# EAGLE schematic SNCHN_II-02p (EAGLE 5.11)
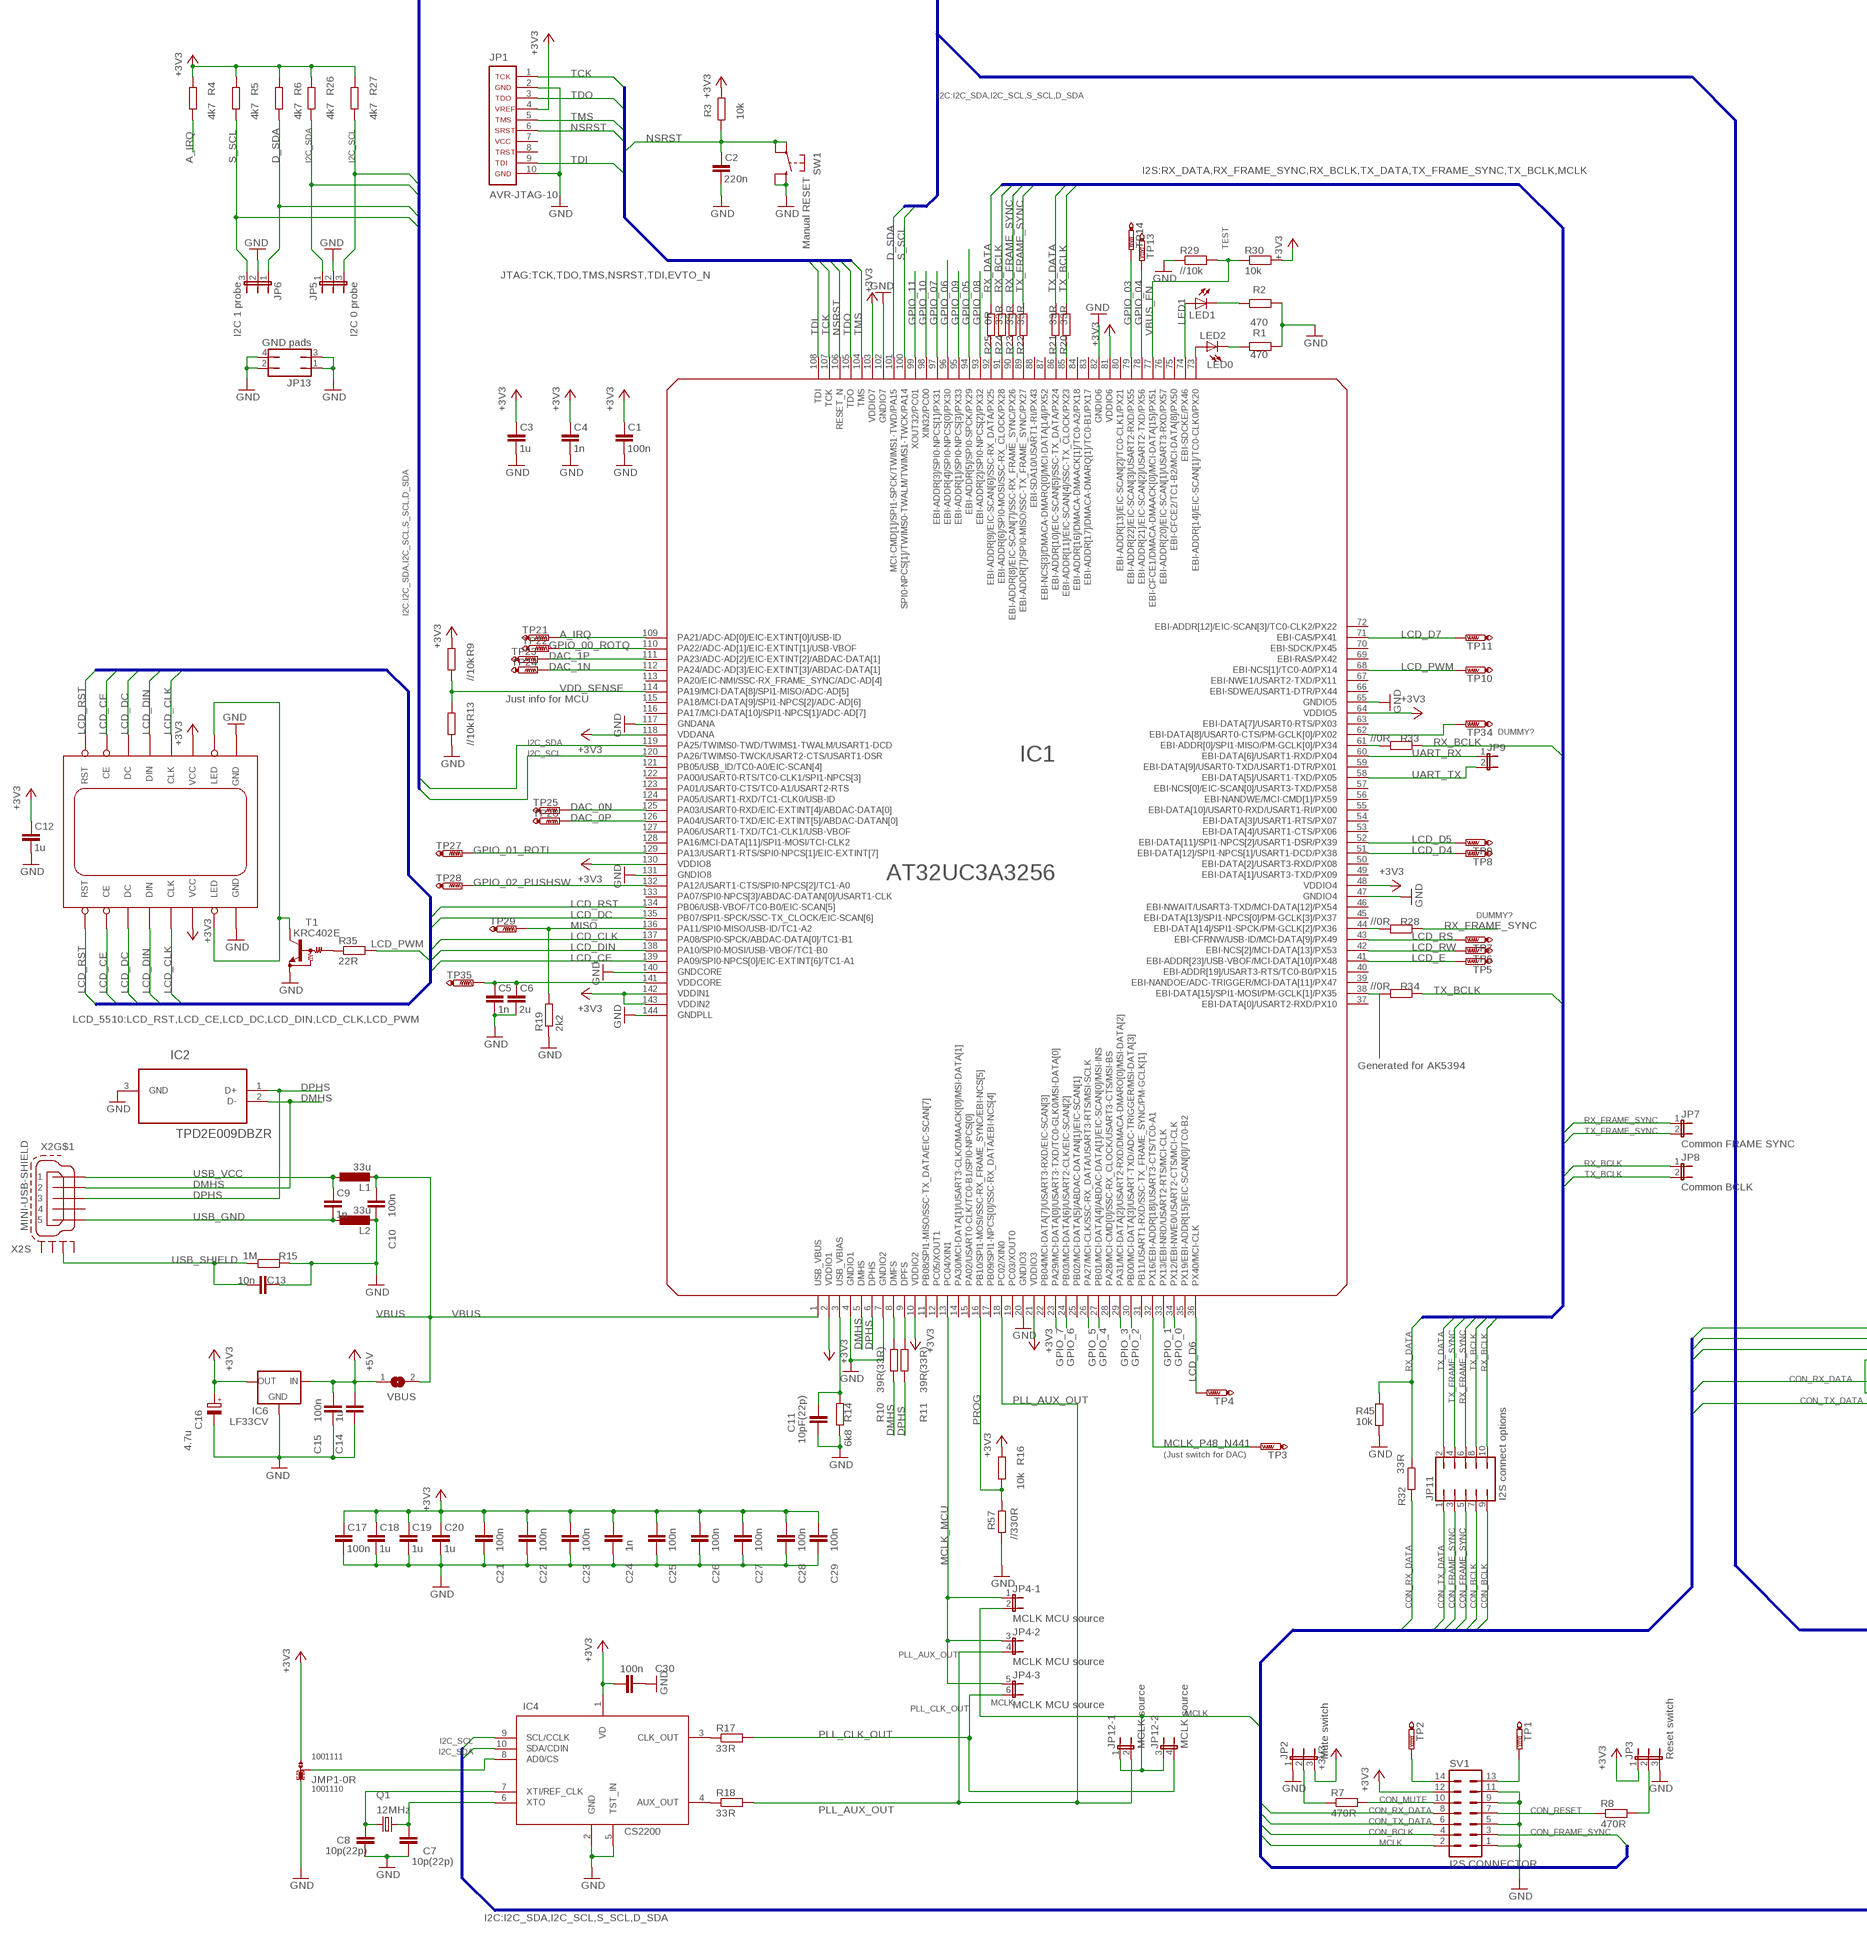
[diagram p0: schematic, sheet 1, part 1 of 2]
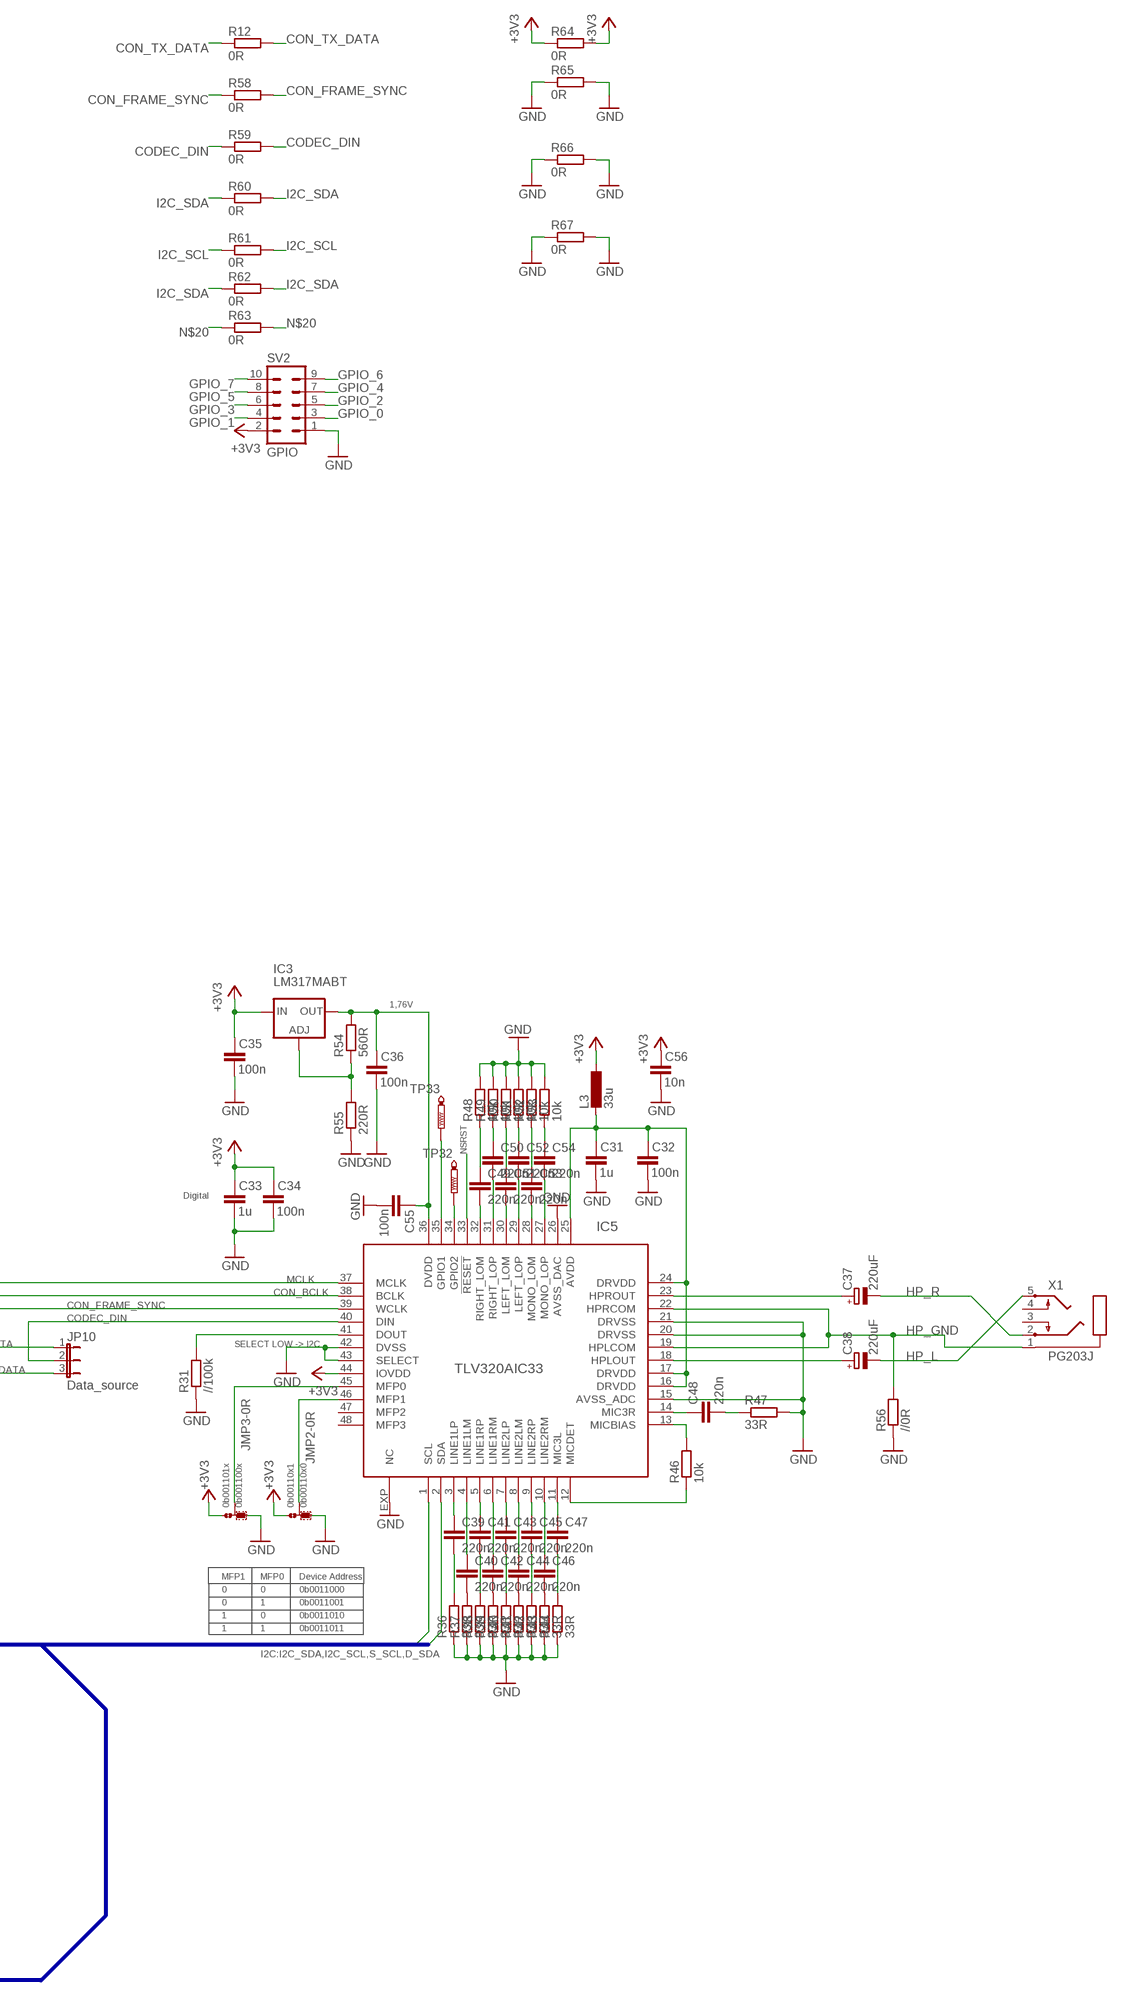
[diagram p1: schematic, sheet 1, part 2 of 2]

## Parts
C1  100n  C-EUC0603  [C0603]
C2  220n  C-EUC0603  [C0603]
C3  1u  C-EUC0603  [C0603]
C4  1n  C-EUC0603  [C0603]
C5  1n  C-EUC0402  [C0402]
C6  2u  C-EUC0805K  [C0805K]
C7  10p(22p)  C-EUC0603  [C0603]
C8  10p(22p)  C-EUC0603  [C0603]
C9  1n  C-EUC0603  [C0603]
C10  100n  C-EUC0603  [C0603]
C11  10pF(22p)  C-EUC0603  [C0603]
C12  1u  C-EUC0603  [C0603]
C13  10n  C-EUC0603  [C0603]
C14  1u  C-EUC0603  [C0603]
C15  100n  C-EUC0603  [C0603]
C16  4.7u  CPOL-EUA/3216-18W  [A/3216-18W]
C17  100n  C-EUC0603  [C0603]
C18  1u  C-EUC0603  [C0603]
C19  1u  C-EUC0603  [C0603]
C20  1u  C-EUC0603  [C0603]
C21  100n  C-EUC0603  [C0603]
C22  100n  C-EUC0402  [C0402]
C23  100n  C-EUC0603  [C0603]
C24  1n  C-EUC0603  [C0603]
C25  100n  C-EUC0603  [C0603]
C26  100n  C-EUC0603  [C0603]
C27  100n  C-EUC0402  [C0402]
C28  100n  C-EUC0603  [C0603]
C29  100n  C-EUC0402  [C0402]
C30  100n  C-EUC0402  [C0402]
C31  1u  C-EUC0603  [C0603]
C32  100n  C-EUC0603  [C0603]
C33  1u  C-EUC0603  [C0603]
C34  100n  C-EUC0402  [C0402]
C35  100n  C-EUC0603  [C0603]
C36  100n  C-EUC0603  [C0603]
C37  220uF  CPOL-EU140CLH-1010  [140CLH-1010]
C38  220uF  CPOL-EU140CLH-1010  [140CLH-1010]
C39  220n  C-EUC0402  [C0402]
C40  220n  C-EUC0402  [C0402]
C41  220n  C-EUC0402  [C0402]
C42  220n  C-EUC0402  [C0402]
C43  220n  C-EUC0402  [C0402]
C44  220n  C-EUC0402  [C0402]
C45  220n  C-EUC0402  [C0402]
C46  220n  C-EUC0402  [C0402]
C47  220n  C-EUC0402  [C0402]
C48  220n  C-EUC0402  [C0402]
C49  220n  C-EUC0402  [C0402]
C50  220n  C-EUC0402  [C0402]
C51  220n  C-EUC0402  [C0402]
C52  220n  C-EUC0402  [C0402]
C53  220n  C-EUC0402  [C0402]
C54  220n  C-EUC0402  [C0402]
C55  100n  C-EUC0603  [C0603]
C56  10n  C-EUC0402  [C0402]
DIS1  LCD_NOKIA_5510  [LCD_NOKIA_5510_PLUS_EXT_BRD]
IC1  AT32UC3A3256  AT32UC3A3256/3128/364  [LQFP144]
IC2  TPD2E009DBZR  [SOT95P237X112-3N]
IC3  LM317MABT  [TO220L1]
IC4  CS2200  [MSOP10]
IC5  TLV320AIC33  [QFN48]
IC6  LF33CV  78XXS  [78XXS]
JMP1  0R-JUMPA  [A0R-JMP]
JMP2  0R-JUMPA  [A0R-JMP]
JMP3  0R-JUMPA  [A0R-JMP]
JP1  AVR-JTAG-10  [AVR-JTAG-10]
JP2  Mute switch  JP2E  [JP2]
JP3  Reset switch  JP2E  [JP2]
JP4  MCLK MCU source  JP3QE  [JP3Q]
JP5  I2C 0 probe  JP2E  [JP2]
JP6  I2C 1 probe  JP2E  [JP2]
JP7  Common FRAME SYNC  JP1E  [JP1]
JP8  Common BCLK  JP1E  [JP1]
JP9  JP1E  [JP1]
JP10  Data_source  JP2E  [JP2]
JP11  I2S connect options  JP5Q  [JP5Q]
JP12  MCLK source  JP2QE  [JP2Q]
JP13  GND pads  JP2Q  [JP2Q]
L1  33u  L0805  [L0805]
L2  33u  L0805  [L0805]
L3  33u  L0805  [L0805]
LED1  LEDCHIP-LED0603  [CHIP-LED0603]
LED2  LEDCHIP-LED0603  [CHIP-LED0603]
Q1  12MHz  CRYSTALHC49U-V  [HC49U-V]
R1  470  R-EU_R0603  [R0603]
R2  470  R-EU_R0603  [R0603]
R3  10k  R-EU_R0603  [R0603]
R4  4k7  R-EU_R0603  [R0603]
R5  4k7  R-EU_R0603  [R0603]
R6  4k7  R-EU_R0603  [R0603]
R7  470R  R-EU_R0603  [R0603]
R8  470R  R-EU_R0603  [R0603]
R9  //10k  R-EU_R0603  [R0603]
R10  39R(33R)  R-EU_R0603  [R0603]
R11  39R(33R)  R-EU_R0603  [R0603]
R12  0R  R-EU_R1206  [R1206]
R13  //10k  R-EU_R0603  [R0603]
R14  6k8  R-EU_R0603  [R0603]
R15  1M  R-EU_R0603  [R0603]
R16  10k  R-EU_R0603  [R0603]
R17  33R  R-EU_R0402  [R0402]
R18  33R  R-EU_R0402  [R0402]
R19  2k2  R-EU_R0402  [R0402]
R20  33R  R-EU_R0603  [R0603]
R21  33R  R-EU_R0603  [R0603]
R22  33R  R-EU_R0603  [R0603]
R23  33R  R-EU_R0603  [R0603]
R24  33R  R-EU_R0603  [R0603]
R25  0R  R-EU_R0603  [R0603]
R26  4k7  R-EU_R0603  [R0603]
R27  4k7  R-EU_R0603  [R0603]
R28  //0R  R-EU_R0402  [R0402]
R29  //10k  R-EU_R0603  [R0603]
R30  10k  R-EU_R0603  [R0603]
R31  //100k  R-EU_R0402  [R0402]
R32  33R  R-EU_R0603  [R0603]
R33  //0R  R-EU_R0402  [R0402]
R34  //0R  R-EU_R1206  [R1206]
R35  22R  R-EU_R0603  [R0603]
R36  33R  R-EU_R0402  [R0402]
R37  33R  R-EU_R0402  [R0402]
R38  33R  R-EU_R0402  [R0402]
R39  33R  R-EU_R0402  [R0402]
R40  33R  R-EU_R0402  [R0402]
R41  33R  R-EU_R0402  [R0402]
R42  33R  R-EU_R0402  [R0402]
R43  33R  R-EU_R0402  [R0402]
R44  33R  R-EU_R0402  [R0402]
R45  10k  R-EU_R0603  [R0603]
R46  10k  R-EU_R0402  [R0402]
R47  33R  R-EU_R0402  [R0402]
R48  10k  R-EU_R0402  [R0402]
R49  10k  R-EU_R0402  [R0402]
R50  10k  R-EU_R0402  [R0402]
R51  10k  R-EU_R0402  [R0402]
R52  10k  R-EU_R0402  [R0402]
R53  10k  R-EU_R0402  [R0402]
R54  560R  R-EU_R0603  [R0603]
R55  220R  R-EU_R0603  [R0603]
R56  //0R  R-EU_M1206  [M1206]
R57  //330R  R-EU_R0603  [R0603]
R58  0R  R-EU_R1206  [R1206]
R59  0R  R-EU_R1206  [R1206]
R60  0R  R-EU_R1206  [R1206]
R61  0R  R-EU_R1206  [R1206]
R62  0R  R-EU_R1206  [R1206]
R63  0R  R-EU_R1206  [R1206]
R64  0R  R-EU_R0603  [R0603]
R65  0R  R-EU_R1206  [R1206]
R66  0R  R-EU_R1206  [R1206]
R67  0R  R-EU_R1206  [R1206]
SV1  I2S CONNECTOR  ML14  [ML14]
SV2  GPIO  ML10L  [ML10L]
SW1  Manual RESET  B1720SMD  [B1720/SMD]
T1  KRC402E  MUN2211T1-NPN_DRIVER-SC59-BEC  [SC59-BEC]
TP1  PTR1B1,27  [B1,27]
TP2  PTR1B1,27  [B1,27]
TP3  PTR1B1,27  [B1,27]
TP4  PTR1B1,27  [B1,27]
TP5  PTR1B1,27  [B1,27]
TP6  PTR1B1,27  [B1,27]
TP7  PTR1B1,27  [B1,27]
TP8  PTR1B1,27  [B1,27]
TP9  PTR1B1,27  [B1,27]
TP10  PTR1B1,27  [B1,27]
TP11  PTR1B1,27  [B1,27]
TP13  PTR1B1,27  [B1,27]
TP14  PTR1B1,27  [B1,27]
TP21  PTR1B1,27  [B1,27]
TP22  PTR1B1,27  [B1,27]
TP23  PTR1B1,27  [B1,27]
TP24  PTR1B1,27  [B1,27]
TP25  PTR1B1,27  [B1,27]
TP26  PTR1B1,27  [B1,27]
TP27  PTR1B1,27  [B1,27]
TP28  PTR1B1,27  [B1,27]
TP29  PTR1B1,27  [B1,27]
TP32  PTR1B1,27  [B1,27]
TP33  PTR1B1,27  [B1,27]
TP34  PTR1B1,27  [B1,27]
TP35  PTR1B1,27  [B1,27]
VBUS  SJ  [SJ]
X1  PG203J  [PG203J]
X2  MINI-USB-SHIELD  MINI-USB-SCHIELD-32005-201  [32005-201]

## Nets
+3V3: C1.1 C3.1 C4.1 C12.1 C16.+ C17.1 C18.1 C19.1 C20.1 C21.1 C22.1 C23.1 C24.1 C25.1 C26.1 C27.1 C28.1 C29.1 C30.1 C33.1 C34.1 C35.1 C56.1 DIS1.6(VCC) DIS1.6@1(VCC) IC1.2(VDDIO1) IC1.10(VDDIO2) IC1.21(VDDIO3) IC1.48(VDDIO4) IC1.64(VDDIO5) IC1.81(VDDIO6) IC1.103(VDDIO7) IC1.118(VDDANA) IC1.130(VDDIO8) IC1.142(VDDIN1) IC1.143(VDDIN2) IC3.3(IN) IC4.1(VD) IC5.44(IOVDD) IC6.OUT JMP1.3 JMP2.3 JMP3.3 JP1.4 JP2.3 JP3.1 L3.1 R3.2 R4.2 R5.2 R6.2 R9.2 R16.2 R26.2 R27.2 R30.2 R64.1 R64.2 SV1.12 SV2.2
+5V: C14.1 C15.1 IC6.IN VBUS.1
A_IRQ: IC1.109(PA21/ADC-AD[0]/EIC-EXTINT[0]/USB-ID) R4.1 TP21.TP
ANALOG_VCC: C31.1 C32.1 IC5.16(DRVDD) IC5.17(DRVDD) IC5.24(DRVDD) IC5.25(AVDD) L3.2
CODEC_DIN: IC5.40(DIN) JP10.2 R59.1 R59.2
CODEC_DOUT: IC5.41(DOUT) R31.2
CON_BCLK: IC5.38(BCLK) JP11.7 JP11.9 SV1.4
CON_FRAME_SYNC: IC5.39(WCLK) JP11.3 JP11.5 R58.1 R58.2 SV1.3
CON_MUTE: R7.2 SV1.10
CON_RESET: R8.1 SV1.7
CON_RX_DATA: JP10.1 R32.1 SV1.8
CON_TX_DATA: JP10.3 JP11.1 R12.1 R12.2 SV1.6
D_SDA: IC1.101(MCI-CMD[1]/SPI1-SPCK/TWIMS1-TWD/PA15) JP6.1 R6.1
DAC_0N: IC1.125(PA03/USART0-RXD/EIC-EXTINT[4]/ABDAC-DATA[0]) TP25.TP
DAC_0P: IC1.126(PA04/USART0-TXD/EIC-EXTINT[5]/ABDAC-DATAN[0]) TP26.TP
DAC_1N: IC1.112(PA24/ADC-AD[3]/EIC-EXTINT[3]/ABDAC-DATA[1]) TP24.TP
DAC_1P: IC1.111(PA23/ADC-AD[2]/EIC-EXTINT[2]/ABDAC-DATA[1]) TP23.TP
DMHS: IC1.5(DMHS) IC2.2(D-) R10.1 X2.2
DPHS: IC1.6(DPHS) IC2.1(D+) R11.1 X2.3
DVDD_1.76: C36.1 C55.1 IC3.2(OUT) IC5.36(DVDD) R54.2
GCLK0: IC1.62(EBI-DATA[8]/USART0-CTS/PM-GCLK[0]/PX02) TP34.TP
GND: C1.2 C2.2 C3.2 C4.2 C5.2 C6.2 C7.2 C8.2 C10.2 C11.2 C12.2 C13.2 C14.2 C15.2 C16.- C17.2 C18.2 C19.2 C20.2 C21.2 C22.2 C23.2 C24.2 C25.2 C26.2 C27.2 C28.2 C29.2 C30.2 C31.2 C32.2 C33.2 C34.2 C35.2 C36.2 C55.2 C56.2 DIS1.8(GND) DIS1.8@1(GND) IC1.4(GNDIO1) IC1.7(GNDIO2) IC1.20(GNDIO3) IC1.47(GNDIO4) IC1.65(GNDIO5) IC1.82(GNDIO6) IC1.102(GNDIO7) IC1.117(GNDANA) IC1.131(GNDIO8) IC1.140(GNDCORE) IC1.144(GNDPLL) IC2.3(GND) IC4.2(GND) IC4.5(TST_IN) IC5.15(AVSS_ADC) IC5.20(DRVSS) IC5.21(DRVSS) IC5.26(AVSS_DAC) IC5.42(DVSS) IC5.43(SELECT) IC5.EXP(NC) IC6.GND JMP1.1 JMP2.1 JMP3.1 JP1.2 JP1.10 JP2.1 JP3.3 JP5.2 JP6.2 JP13.1 JP13.2 JP13.3 JP13.4 L2.2 R1.2 R2.2 R13.1 R14.1 R15.1 R19.1 R29.1 R31.1 R36.1 R37.1 R38.1 R39.1 R40.1 R41.1 R42.1 R43.1 R44.1 R45.2 R47.2 R48.2 R49.2 R50.2 R51.2 R52.2 R53.2 R55.1 R56.1 R57.1 R65.1 R65.2 R66.1 R66.2 R67.1 R67.2 SV1.1 SV1.5 SV1.9 SV1.11 SV2.1 SW1.P$3 SW1.P$4 T1.E
GPIO_0: IC1.34(PX12/EBI-NWE0/USART2-CTS/MCI-CLK) SV2.3
GPIO_00_ROTQ: IC1.110(PA22/ADC-AD[1]/EIC-EXTINT[1]/USB-VBOF) TP22.TP
GPIO_1: IC1.33(PX13/EBI-NRD/USART2-RTS/MCI-CLK) SV2.4
GPIO_01_ROTI: IC1.129(PA13/USART1-RTS/SPI0-NPCS[1]/EIC-EXTINT[7]) TP27.TP
GPIO_2: IC1.30(PB00/MCI-DATA[3]/USART-TXD/ADC-TRIGGER/MSI-DATA[3]) SV2.5
GPIO_02_PUSHSW: IC1.132(PA12/USART1-CTS/SPI0-NPCS[2]/TC1-A0) TP28.TP
GPIO_03: IC1.79(EBI-ADDR[22]/EIC-SCAN[3]/USART2-RXD/PX55) TP14.TP
GPIO_3: IC1.29(PA31/MCI-DATA[2]/USART2-RXD/DMACA-DMARO[0]/MSI-DATA[2]) SV2.6
GPIO_04: IC1.78(EBI-ADDR[21]/EIC-SCAN[2]/USART2-TXD/PX56) TP13.TP
GPIO_4: IC1.27(PB01/MCI-DATA[4]/ABDAC-DATA[1]/EIC-SCAN[0]/MSI-INS) SV2.7
GPIO_05: IC1.94(EBI-ADDR[5]/SPI0-SPCK/PX29)
GPIO_5: IC1.26(PA27/MCI-CLK/SSC-RX_DATA/USART3-RTS/MSI-SCLK) SV2.8
GPIO_06: IC1.96(EBI-ADDR[4]/SPI0-NPCS[0]/PX30)
GPIO_6: IC1.24(PB03/MCI-DATA[6]/USART2-CLK/EIC-SCAN[2]) SV2.9
GPIO_07: IC1.97(EBI-ADDR[3]/SPI0-NPCS[1]/PX31)
GPIO_7: IC1.23(PA29/MCI-DATA[0]/USART3-TXD/TC0-GLK0/MSI-DATA[0]) SV2.10
GPIO_08: IC1.93(EBI-ADDR[2]/SPI0-NPCS[2]/PX32)
GPIO_09: IC1.95(EBI-ADDR[1]/SPI0-NPCS[3]/PX33)
GPIO_10: IC1.98(XIN32/PC00)
GPIO_11: IC1.99(XOUT32/PC01)
HP_GND: IC5.19(HPLCOM) IC5.22(HPRCOM) R56.2 X1.1
HP_L: C38.- X1.5
HP_R: C37.- X1.2
HPLOUT_TLV: C38.+ IC5.18(HPLOUT)
HPROUT_TLV: C37.+ IC5.23(HPROUT)
I2C_SCL: IC1.120(PA26/TWIMS0-TWCK/USART2-CTS/USART1-DSR) IC4.9(SCL/CCLK) IC5.1(SCL) JP5.3 R27.1 R61.1 R61.2
I2C_SDA: IC1.119(PA25/TWIMS0-TWD/TWIMS1-TWALM/USART1-DCD) IC4.10(SDA/CDIN) IC5.2(SDA) JP5.1 R26.1 R60.1 R60.2 R62.1 R62.2
LCD_CE: DIS1.2(CE) DIS1.2@1(CE) IC1.139(PA09/SPI0-NPCS[0]/EIC-EXTINT[6]/TC1-A1)
LCD_CLK: DIS1.5(CLK) DIS1.5@1(CLK) IC1.137(PA08/SPI0-SPCK/ABDAC-DATA[0]/TC1-B1)
LCD_D4: IC1.51(EBI-DATA[12]/SPI1-NPCS[1]/USART1-DCD/PX38) TP8.TP
LCD_D5: IC1.52(EBI-DATA[11]/SPI1-NPCS[2]/USART1-DSR/PX39) TP9.TP
LCD_D6: IC1.36(PX40/MCI-CLK) TP4.TP
LCD_D7: IC1.71(EBI-CAS/PX41) TP11.TP
LCD_DC: DIS1.3(DC) DIS1.3@1(DC) IC1.135(PB07/SPI1-SPCK/SSC-TX_CLOCK/EIC-SCAN[6])
LCD_DIN: DIS1.4(DIN) DIS1.4@1(DIN) IC1.138(PA10/SPI0-MOSI/USB-VBOF/TC1-B0)
LCD_E: IC1.41(EBI-ADDR[23]/USB-VBOF/MCI-DATA[10]/PX48) TP5.TP
LCD_PWM: IC1.68(EBI-NCS[1]/TC0-A0/PX14) R35.2 TP10.TP
LCD_RS: IC1.43(EBI-CFRNW/USB-ID/MCI-DATA[9]/PX49) TP7.TP
LCD_RST: DIS1.1(RST) DIS1.1@1(RST) IC1.134(PB06/USB-VBOF/TC0-B0/EIC-SCAN[5])
LCD_RW: IC1.42(EBI-NCS[2]/MCI-DATA[13]/PX53) TP6.TP
LED0: IC1.73(EBI-ADDR[14]/EIC-SCAN[1]/TC0-CLK0/PX20) LED2.A
LED1: IC1.74(EBI-SDCKE/PX46) LED1.A
MCLK: IC5.37(MCLK) JP4.2 JP12.1 JP12.3 SV1.2
MCLK_MCU: IC1.13(PC04/XIN1) JP4.1 JP4.3 JP4.5
MCLK_P48_N441: IC1.32(PX16/EBI-ADDR[18]/USART3-CTS/TC0-A1) TP3.TP
MFP0: IC5.45(MFP0) JMP3.2
MFP1: IC5.46(MFP1) JMP2.2
MISO: IC1.136(PA11/SPI0-MISO/USB-ID/TC1-A2) R19.2 TP29.TP
N$1: C8.1 IC4.7(XTI/REF_CLK) Q1.1
N$2: IC4.3(CLK_OUT) R17.1
N$4: JP2.2 R7.1
N$5: IC4.8(AD0/CS) JMP1.2
N$6: JP3.2 R8.2
N$7: SV1.14 TP2.TP
N$8: IC4.4(AUX_OUT) R18.1
N$9: SV1.13 TP1.TP
N$10: IC5.12(MICDET) R46.1
N$11: IC1.85(EBI-ADDR[11]/EIC-SCAN[4]/SSC-TX_CLOCK/PX23) R20.1
N$12: IC1.86(EBI-ADDR[10]/EIC-SCAN[5]/SSC-TX_DATA/PX24) R21.1
N$13: IC1.89(EBI-ADDR[7]/SPI0-MISO/SSC-TX_FRAME_SYNC/PX27) R22.1
N$14: IC1.90(EBI-ADDR[8]/EIC-SCAN[7]/SSC-RX_FRAME_SYNC/PX26) R23.1
N$15: IC1.91(EBI-ADDR[6]/SPI0-MOSI/SSC-RX_CLOCK/PX28) R24.1
N$16: IC1.92(EBI-ADDR[9]/EIC-SCAN[6]/SSC-RX_DATA/PX25) R25.1
N$17: IC1.44(EBI-DATA[14]/SPI1-SPCK/PM-GCLK[2]/PX36) R28.2
N$18: IC1.61(EBI-ADDR[0]/SPI1-MISO/PM-GCLK[0]/PX34) R33.2
N$19: IC1.38(EBI-DATA[15]/SPI1-MOSI/PM-GCLK[1]/PX35) R34.2
N$20: R35.1 R63.1 R63.2 T1.B
N$21: DIS1.7(LED) DIS1.7@1(LED) T1.C
N$22: IC5.13(MICBIAS) R46.2
N$23: C42.2 R39.2
N$24: C39.1 IC5.3(LINE1LP)
N$25: C39.2 R36.2
N$26: C40.1 IC5.4(LINE1LM)
N$27: C41.1 IC5.5(LINE1RP)
N$28: C40.2 R37.2
N$29: C41.2 R38.2
N$30: C42.1 IC5.6(LINE1RM)
N$31: C43.1 IC5.7(LINE2LP)
N$32: C43.2 R40.2
N$33: C44.1 IC5.8(LINE2LM)
N$34: C44.2 R41.2
N$35: C45.1 IC5.9(LINE2RP)
N$36: C45.2 R42.2
N$37: C46.1 IC5.10(LINE2RM)
N$38: C48.1 IC5.14(MIC3R)
N$40: C46.2 R43.2
N$41: C49.1 R48.1
N$42: C49.2 IC5.32(RIGHT_LOM)
N$43: C50.2 IC5.31(RIGHT_LOP)
N$44: C50.1 R49.1
N$45: C51.1 R50.1
N$46: C51.2 IC5.30(LEFT_LOM)
N$47: C47.1 IC5.11(MIC3L)
N$48: C47.2 R44.2
N$49: C52.1 R51.1
N$50: C53.1 R52.1
N$51: C54.1 R53.1
N$52: C52.2 IC5.29(LEFT_LOP)
N$53: C53.2 IC5.28(MONO_LOM)
N$54: C54.2 IC5.27(MONO_LOP)
N$56: C48.2 R47.1
N$57: IC5.35(GPIO1) TP33.TP
N$58: IC5.34(GPIO2) TP32.TP
N$60: IC3.1(ADJ) R54.1 R55.2
N$67: C11.1 IC1.3(USB_VBIAS) R14.2
N$69: IC1.8(DMFS) R10.2
N$74: IC1.9(DPFS) R11.2
N$80: LED1.C R2.1
N$82: LED2.C R1.1
N$83: C7.1 IC4.6(XTO) Q1.2
NSRST: C2.1 IC1.106(RESET_N) IC5.33(!RESET) JP1.6 R3.1 SW1.P$1 SW1.P$2
PLL_AUX_OUT: IC1.18(PC02/XIN0) JP4.4 JP12.2 R18.2
PLL_CLK_OUT: JP4.6 JP12.4 R17.2
PROG: IC1.16(PB10/SPI1-MOSI/SSC-RX_FRAME_SYNC/EBI-NCS[5]) R16.1 R57.2
RX_BCLK: JP8.1 JP11.10 R24.2 R33.1
RX_DATA: R25.2 R32.2 R45.1
RX_FRAME_SYNC: JP7.1 JP11.6 R23.2 R28.1
S_SCL: IC1.100(SPI0-NPCS[1]/TWIMS0-TWALM/TWIMS1-TWCK/PA14) JP6.3 R5.1
TCK: IC1.107(TCK) JP1.1
TDI: IC1.108(TDI) JP1.9
TDO: IC1.105(TDO) JP1.3
TMS: IC1.104(TMS) JP1.5
TX_BCLK: JP8.2 JP11.8 R20.2 R34.1
TX_DATA: JP11.2 R21.2
TX_FRAME_SYNC: JP7.2 JP11.4 R22.2
UART_RX: IC1.60(EBI-DATA[6]/USART1-RXD/PX04) JP9.1
UART_TX: IC1.58(EBI-DATA[5]/USART1-TXD/PX05) JP9.2
USB_GND: C9.2 L2.1 X2.5
USB_SHIELD: C13.1 R15.2 X2.M2(S:S2)
USB_VCC: C9.1 L1.1 X2.1
VBUS: C10.1 IC1.1(USB_VBUS) L1.2 VBUS.2
VBUS_EN: IC1.77(EBI-CFCE1/DMACA-DMAACK[0]/MCI-DATA[15]/PX51) R29.2 R30.1
VDD_SENSE: IC1.114(PA19/MCI-DATA[8]/SPI1-MISO/ADC-AD[5]) R9.1 R13.2
VDDCORE: C5.1 C6.1 IC1.141(VDDCORE) TP35.TP
Unconnected: IC1.11(PB08/SPI1-MISO/SSC-TX_DATA/EIC-SCAN[7]) IC1.12(PC05/XOUT1) IC1.14(PA30/MCI-DATA[1]/USART3-CLK/DMAACK[0]/MSI-DATA[1]) IC1.15(PA02/USART0-CLK/TC0-B1/SPI0-NPCS[0]) IC1.17(PB09/SPI1-NPCS[0]/SSC-RX_DATA/EBI-NCS[4]) IC1.19(PC03/XOUT0) IC1.22(PB04/MCI-DATA[7]/USART3-RXD/EIC-SCAN[3]) IC1.25(PB02/MCI-DATA[5]/ABDAC-DATAN[1]/EIC-SCAN[1]) IC1.28(PA28/MCI-CMD[0]/SSC-RX_CLOCK/USART3-CTS/MSI-BS) IC1.31(PB11/USART1-RXD/SSC-TX_FRAME_SYNC/PM-GCLK[1]) IC1.35(PX19/EBI-ADDR[15]/EIC-SCAN[0]/TC0-B2) IC1.37(EBI-DATA[0]/USART2-RXD/PX10) IC1.39(EBI-NANDOE/ADC-TRIGGER/MCI-DATA[11]/PX47) IC1.40(EBI-ADDR[19]/USART3-RTS/TC0-B0/PX15) IC1.45(EBI-DATA[13]/SPI1-NPCS[0]/PM-GCLK[3]/PX37) IC1.46(EBI-NWAIT/USART3-TXD/MCI-DATA[12]/PX54) IC1.49(EBI-DATA[1]/USART3-TXD/PX09) IC1.50(EBI-DATA[2]/USART3-RXD/PX08) IC1.53(EBI-DATA[4]/USART1-CTS/PX06) IC1.54(EBI-DATA[3]/USART1-RTS/PX07) IC1.55(EBI-DATA[10]/USART0-RXD/USART1-RI/PX00) IC1.56(EBI-NANDWE/MCI-CMD[1]/PX59) IC1.57(EBI-NCS[0]/EIC-SCAN[0]/USART3-TXD/PX58) IC1.59(EBI-DATA[9]/USART0-TXD/USART1-DTR/PX01) IC1.63(EBI-DATA[7]/USART0-RTS/PX03) IC1.66(EBI-SDWE/USART1-DTR/PX44) IC1.67(EBI-NWE1/USART2-TXD/PX11) IC1.69(EBI-RAS/PX42) IC1.70(EBI-SDCK/PX45) IC1.72(EBI-ADDR[12]/EIC-SCAN[3]/TC0-CLK2/PX22) IC1.75(EBI-CFCE2/TC1-B2/MCI-DATA[8]/PX50) IC1.76(EBI-ADDR[20]/EIC-SCAN[1]/USART3-RXD/PX57) IC1.80(EBI-ADDR[13]/EIC-SCAN[2]/TC0-CLK1/PX21) IC1.83(EBI-ADDR[17]/DMACA-DMARQ[1]/TC0-B1/PX17) IC1.84(EBI-ADDR[16]/DMACA-DMAACK[1]/TC0-A2/PX18) IC1.87(EBI-NCS[3]/DMACA-DMARQ[0]/MCI-DATA[14]/PX52) IC1.88(EBI-SDA10/USART1-RI/PX43) IC1.113(PA20/EIC-NMI/SSC-RX_FRAME_SYNC/ADC-AD[4]) IC1.115(PA18/MCI-DATA[9]/SPI1-NPCS[2]/ADC-AD[6]) IC1.116(PA17/MCI-DATA[10]/SPI1-NPCS[1]/ADC-AD[7]) IC1.121(PB05/USB_ID/TC0-A0/EIC-SCAN[4]) IC1.122(PA00/USART0-RTS/TC0-CLK1/SPI1-NPCS[3]) IC1.123(PA01/USART0-CTS/TC0-A1/USART2-RTS) IC1.124(PA05/USART1-RXD/TC1-CLK0/USB-ID) IC1.127(PA06/USART1-TXD/TC1-CLK1/USB-VBOF) IC1.128(PA16/MCI-DATA[11]/SPI1-MOSI/TCI-CLK2) IC1.133(PA07/SPI0-NPCS[3]/ABDAC-DATAN[0]/USART1-CLK) IC5.47(MFP2) IC5.48(MFP3) JP1.7 JP1.8 X1.3 X1.4 X2.4 X2.M1(S:S1) X2.M3(S:S3) X2.M4(S:S4)

## Buses
JTAG:TCK,TDO,TMS,NSRST,TDI,EVTO_N
I2S:RX_DATA,RX_FRAME_SYNC,RX_BCLK,TX_DATA,TX_FRAME_SYNC,TX_BCLK,MCLK
CON_I2S:CON_RX_DATA,CON_TX_DATA,CON_BCLK,MCLK,CON_FRAME_SYNC
I2C:I2C_SDA,I2C_SCL,S_SCL,D_SDA
LCD_5510:LCD_RST,LCD_CE,LCD_DC,LCD_DIN,LCD_CLK,LCD_PWM

## Notes on the sheet
- TEST
- Just info for MCU
- DUMMY?
- DUMMY?
- Generated for AK5394
- 1,76V
- Digital
- SELECT LOW -> I2C
- (Just switch for DAC)
- 0b001101x | 0b001100x | 0b00110x1 | 0b00110x0
- MFP1 | MFP0 | Device Address
- 0 | 0 | 0b0011000
- 0 | 1 | 0b0011001
- 1 | 0 | 0b0011010
- 1 | 1 | 0b0011011
- 1001111
- 1001110

## Library data of the parts
C1-C15 C17-C36 C39-C56 = rcl:C-EU: CAPACITOR, European symbol
C16 C37 C38 = rcl:CPOL-EU: POLARIZED CAPACITOR, European symbol
DIS1 = _ALCZ_Display:LCD_NOKIA_5510: Display from NOKIA 5510 Used SPI interface up to 4Mbit/s. LED backlight is turned on by LOW level!
IC1 = atmel-avr32-michel-rev1_Martin:AT32UC3A3256/3128/364: AT32UC3A3xxx series 256/128/64 kB flash CPU max 84 MHz 64 kB RAM High-Speed USB 2.0 (480 Mbit/s) 110 GPIO 2 TWI 4 USART 2 SPI 1 SSC 6 Timer/Counter
IC2 = esd:TPD2E009DBZR: (6 GBPS) DIFFERENTIAL INTERFACE; MPN: TPD2E009DBZR; OC_FARNELL: 1755715; OC_NEWARK: 14R9549; PACKAGE: SOT-23-3; SUPPLIER: Texas Instruments
IC3 = v-reg:LM317?*: 500 mA Adjustable Output Positive Voltage Regulator Source: http://www.onsemi.co.jp .. LM317M-D.PDF
IC4 = _ALCZ_Mixed_signal_IC:CS2200: Fractional-N Frequency Synthesizer The CS2200-CP supports both I²C and SPI for full software control. by Martin Stejskal
IC5 = _ALCZ_Mixed_signal_IC:TLV320AIC33: Low Power Stereo Audio CODEC for Portable Audio/Telephony 16/20/24/32-Bit Data Supports Rates From 8 kHz to 96 kHz 3D/Bass/Treble/EQ/De-emphasis Effects by Martin Stejskal
IC6 = v-reg:78XXS: VOLTAGE REGULATOR
JMP1-JMP3 = jump-0r-smd:0R-JUMP: SMD 0R 0805 Jumper
JP1 = atmel-avr32-michel-rev1_Martin:AVR-JTAG-10: AVR JTAG Debug/Programming Header
JP2 JP3 JP5 JP6 JP10 = jumper:JP2E: JUMPER
JP4 = jumper:JP3QE: JUMPER
JP7-JP9 = jumper:JP1E: JUMPER
JP11 = jumper:JP5Q: JUMPER
JP12 = jumper:JP2QE: JUMPER
JP13 = jumper:JP2Q: JUMPER
L1-L3 = _ALCZ_Passives:L: INDUCTOR chip
LED1 LED2 = led:LED: LED OSRAM: - CHIPLED LG R971, LG N971, LY N971, LG Q971, LY Q971, LO R971, LY R971 LH N974, LH R974 LS Q976, LO Q976, LY Q976 LO Q996 - Hyper CHIPLED LW Q18S LB Q993, LB Q99A, LB R99A - SideLED LS A670, LO A670, LY A670, LG A670, LP A670 LB A673, LV A673, LT A673, LW A673 LH A674 LY A675 LS A676, LA A676, LO A676, LY A676, LW A676 LS A679, LY A679, LG A679 - Hyper Micro SIDELED® LS Y876, LA Y876, LO Y876, LY Y876 LT Y87S - SmartLED LW L88C, LW L88S LB L89C, LB L89S, LG L890 LS L89K, LO L89K, LY L89K LS L896, LA L896, LO L896, LY L896 - TOPLED LS T670, LO T670, LY T670, LG T670, LP T670 LSG T670, LSP T670, LSY T670, LOP T670, LYG T670 LG T671, LOG T671, LSG T671 LB T673, LV T673, LT T673, LW T673 LH T674 LS T676, LA T676, LO T676, LY T676, LB T676, LH T676, LSB T676, LW T676 LB T67C, LV T67C, LT T67C, LS T67K, LO T67K, LY T67K, LW E67C LS E67B, LA E67B, LO E67B, LY E67B, LB E67C, LV E67C, LT E67C LW T67C LS T679, LY T679, LG T679 LS T770, LO T770, LY T770, LG T770, LP T770 LB T773, LV T773, LT T773, LW T773 LH T774 LS E675, LA E675, LY E675, LS T675 LS T776, LA T776, LO T776, LY T776, LB T776 LHGB T686 LT T68C, LB T68C - Hyper Mini TOPLED® LB M676 - Mini TOPLED Santana® LG M470 LS M47K, LO M47K, LY M47K Source: http://www.osram.convergy.de LUXEON: - LUMILED® LXK2-PW12-R00, LXK2-PW12-S00, LXK2-PW14-U00, LXK2-PW14-V00 LXK2-PM12-R00, LXK2-PM12-S00, LXK2-PM14-U00 LXK2-PE12-Q00, LXK2-PE12-R00, LXK2-PE12-S00, LXK2-PE14-T00, LXK2-PE14-U00 LXK2-PB12-K00, LXK2-PB12-L00, LXK2-PB12-M00, LXK2-PB14-N00, LXK2-PB14-P00, LXK2-PB14-Q00 LXK2-PR12-L00, LXK2-PR12-M00, LXK2-PR14-Q00, LXK2-PR14-R00 LXK2-PD12-Q00, LXK2-PD12-R00, LXK2-PD12-S00 LXK2-PH12-R00, LXK2-PH12-S00 LXK2-PL12-P00, LXK2-PL12-Q00, LXK2-PL12-R00 Source: www.luxeon.com KINGBRIGHT: KA-3528ASYC Source: www.kingbright.com
Q1 = crystal:CRYSTAL: CRYSTAL
R1-R67 = rcl:R-EU_: RESISTOR, European symbol
SV1 = con-ml:ML14: HARTING; OC_FARNELL: unknown; OC_NEWARK: unknown
SV2 = con-ml:ML10L: HARTING; OC_FARNELL: unknown; OC_NEWARK: unknown
SW1 = _ALCZ_Switch:B1720: Tact switch 12V 0.05A, SMD
T1 = transistor:*-NPN_DRIVER-: NPN Bias Resistor Transistor
TP1-TP11 TP13 TP14 TP21-TP29 TP32-TP35 = testpad:PTR1: TEST PIN
VBUS = jumper:SJ: SMD solder JUMPER
X1 = con-hirschmann:PG203J: MIC/HEADPHONE JACK KS-S stereo microphone/headphone jack PG203JN (Schukat); OC_FARNELL: unknown; OC_NEWARK: unknown
X2 = con-cypressindustries:MINI-USB-SCHIELD-: MINI USB-B Conector Source: www.cypressindustries.com; OC_FARNELL: unknown; OC_NEWARK: unknown